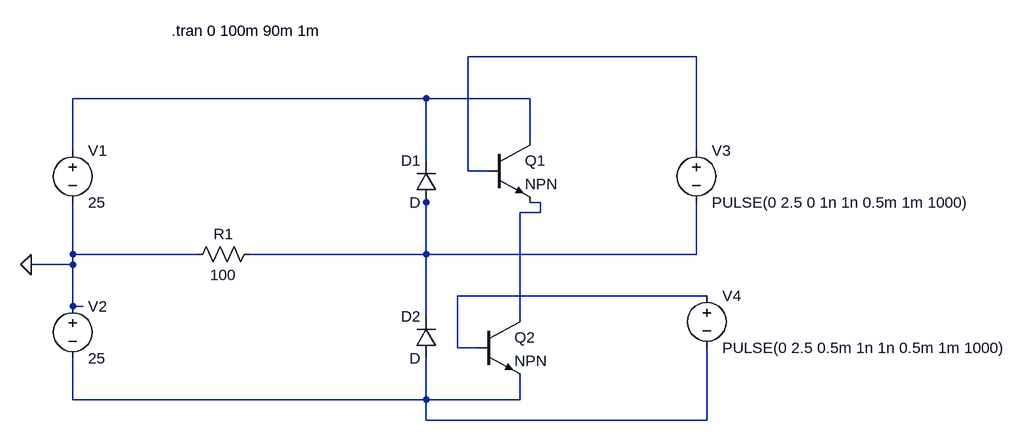
[diagram p0: schematic HalfwaveInverterRload.asc]
HalfwaveInverterRload.asc, the LTspice schematic file:
Version 4
SHEET 1 1404 680
WIRE 912 -16 560 -16
WIRE 496 48 -48 48
WIRE 656 48 496 48
WIRE 656 112 656 48
WIRE -48 128 -48 48
WIRE 912 128 912 -16
WIRE 496 144 496 48
WIRE 560 160 560 -16
WIRE 592 160 560 160
WIRE 496 208 496 192
WIRE 672 208 656 208
WIRE 672 224 672 208
WIRE 672 224 640 224
WIRE -48 288 -48 208
WIRE 144 288 -48 288
WIRE 496 288 496 208
WIRE 496 288 224 288
WIRE 912 288 912 208
WIRE 912 288 496 288
WIRE -48 304 -48 288
WIRE -48 304 -112 304
WIRE 928 352 544 352
WIRE -48 368 -48 304
WIRE -32 368 -48 368
WIRE 496 384 496 288
WIRE 640 384 640 224
WIRE 544 432 544 352
WIRE 576 432 544 432
WIRE -48 512 -48 448
WIRE 496 512 496 448
WIRE 496 512 -48 512
WIRE 640 512 640 480
WIRE 640 512 496 512
WIRE 496 544 496 512
WIRE 928 544 928 432
WIRE 928 544 496 544
FLAG -112 304 0
SYMBOL voltage -48 112 R0
SYMATTR InstName V1
SYMATTR Value 25
SYMBOL voltage -48 352 R0
SYMATTR InstName V2
SYMATTR Value 25
SYMBOL res 240 272 R90
WINDOW 0 0 56 VBottom 2
WINDOW 3 32 56 VTop 2
SYMATTR InstName R1
SYMATTR Value 100
SYMBOL diode 512 208 R180
WINDOW 0 24 64 Left 2
WINDOW 3 24 0 Left 2
SYMATTR InstName D1
SYMBOL diode 512 448 R180
WINDOW 0 24 64 Left 2
WINDOW 3 24 0 Left 2
SYMATTR InstName D2
SYMBOL npn 576 384 R0
SYMATTR InstName Q2
SYMBOL npn 592 112 R0
SYMATTR InstName Q1
SYMBOL voltage 912 112 R0
SYMATTR InstName V3
SYMATTR Value PULSE(0 2.5 0 1n 1n 0.5m 1m 1000)
SYMBOL voltage 928 336 R0
SYMATTR InstName V4
SYMATTR Value PULSE(0 2.5 0.5m 1n 1n 0.5m 1m 1000)
TEXT 104 -56 Left 2 !.tran 0 100m 90m 1m

The netlist it stands for:
* HalfwaveInverterRload.asc
V1 N002 0 25
V2 0 N006 25
R1 N003 0 100
D1 N003 N002 D
D2 N006 N003 D
Q2 N004 N005 N006 0 NPN
Q1 N002 N001 N004 0 NPN
V3 N001 N003 PULSE(0 2.5 0 1n 1n 0.5m 1m 1000)
V4 N005 N006 PULSE(0 2.5 0.5m 1n 1n 0.5m 1m 1000)
.model D D
.lib standard.dio
.model NPN NPN
.model PNP PNP
.lib standard.bjt
.tran 0 100m 90m 1m
.backanno
.end